# EasyEDA schematic bike_meter.json
TITLE: Sheet_1; REV: 1.0; Date: 2021-02-28; Sheet: 1/1; Company: Your Company
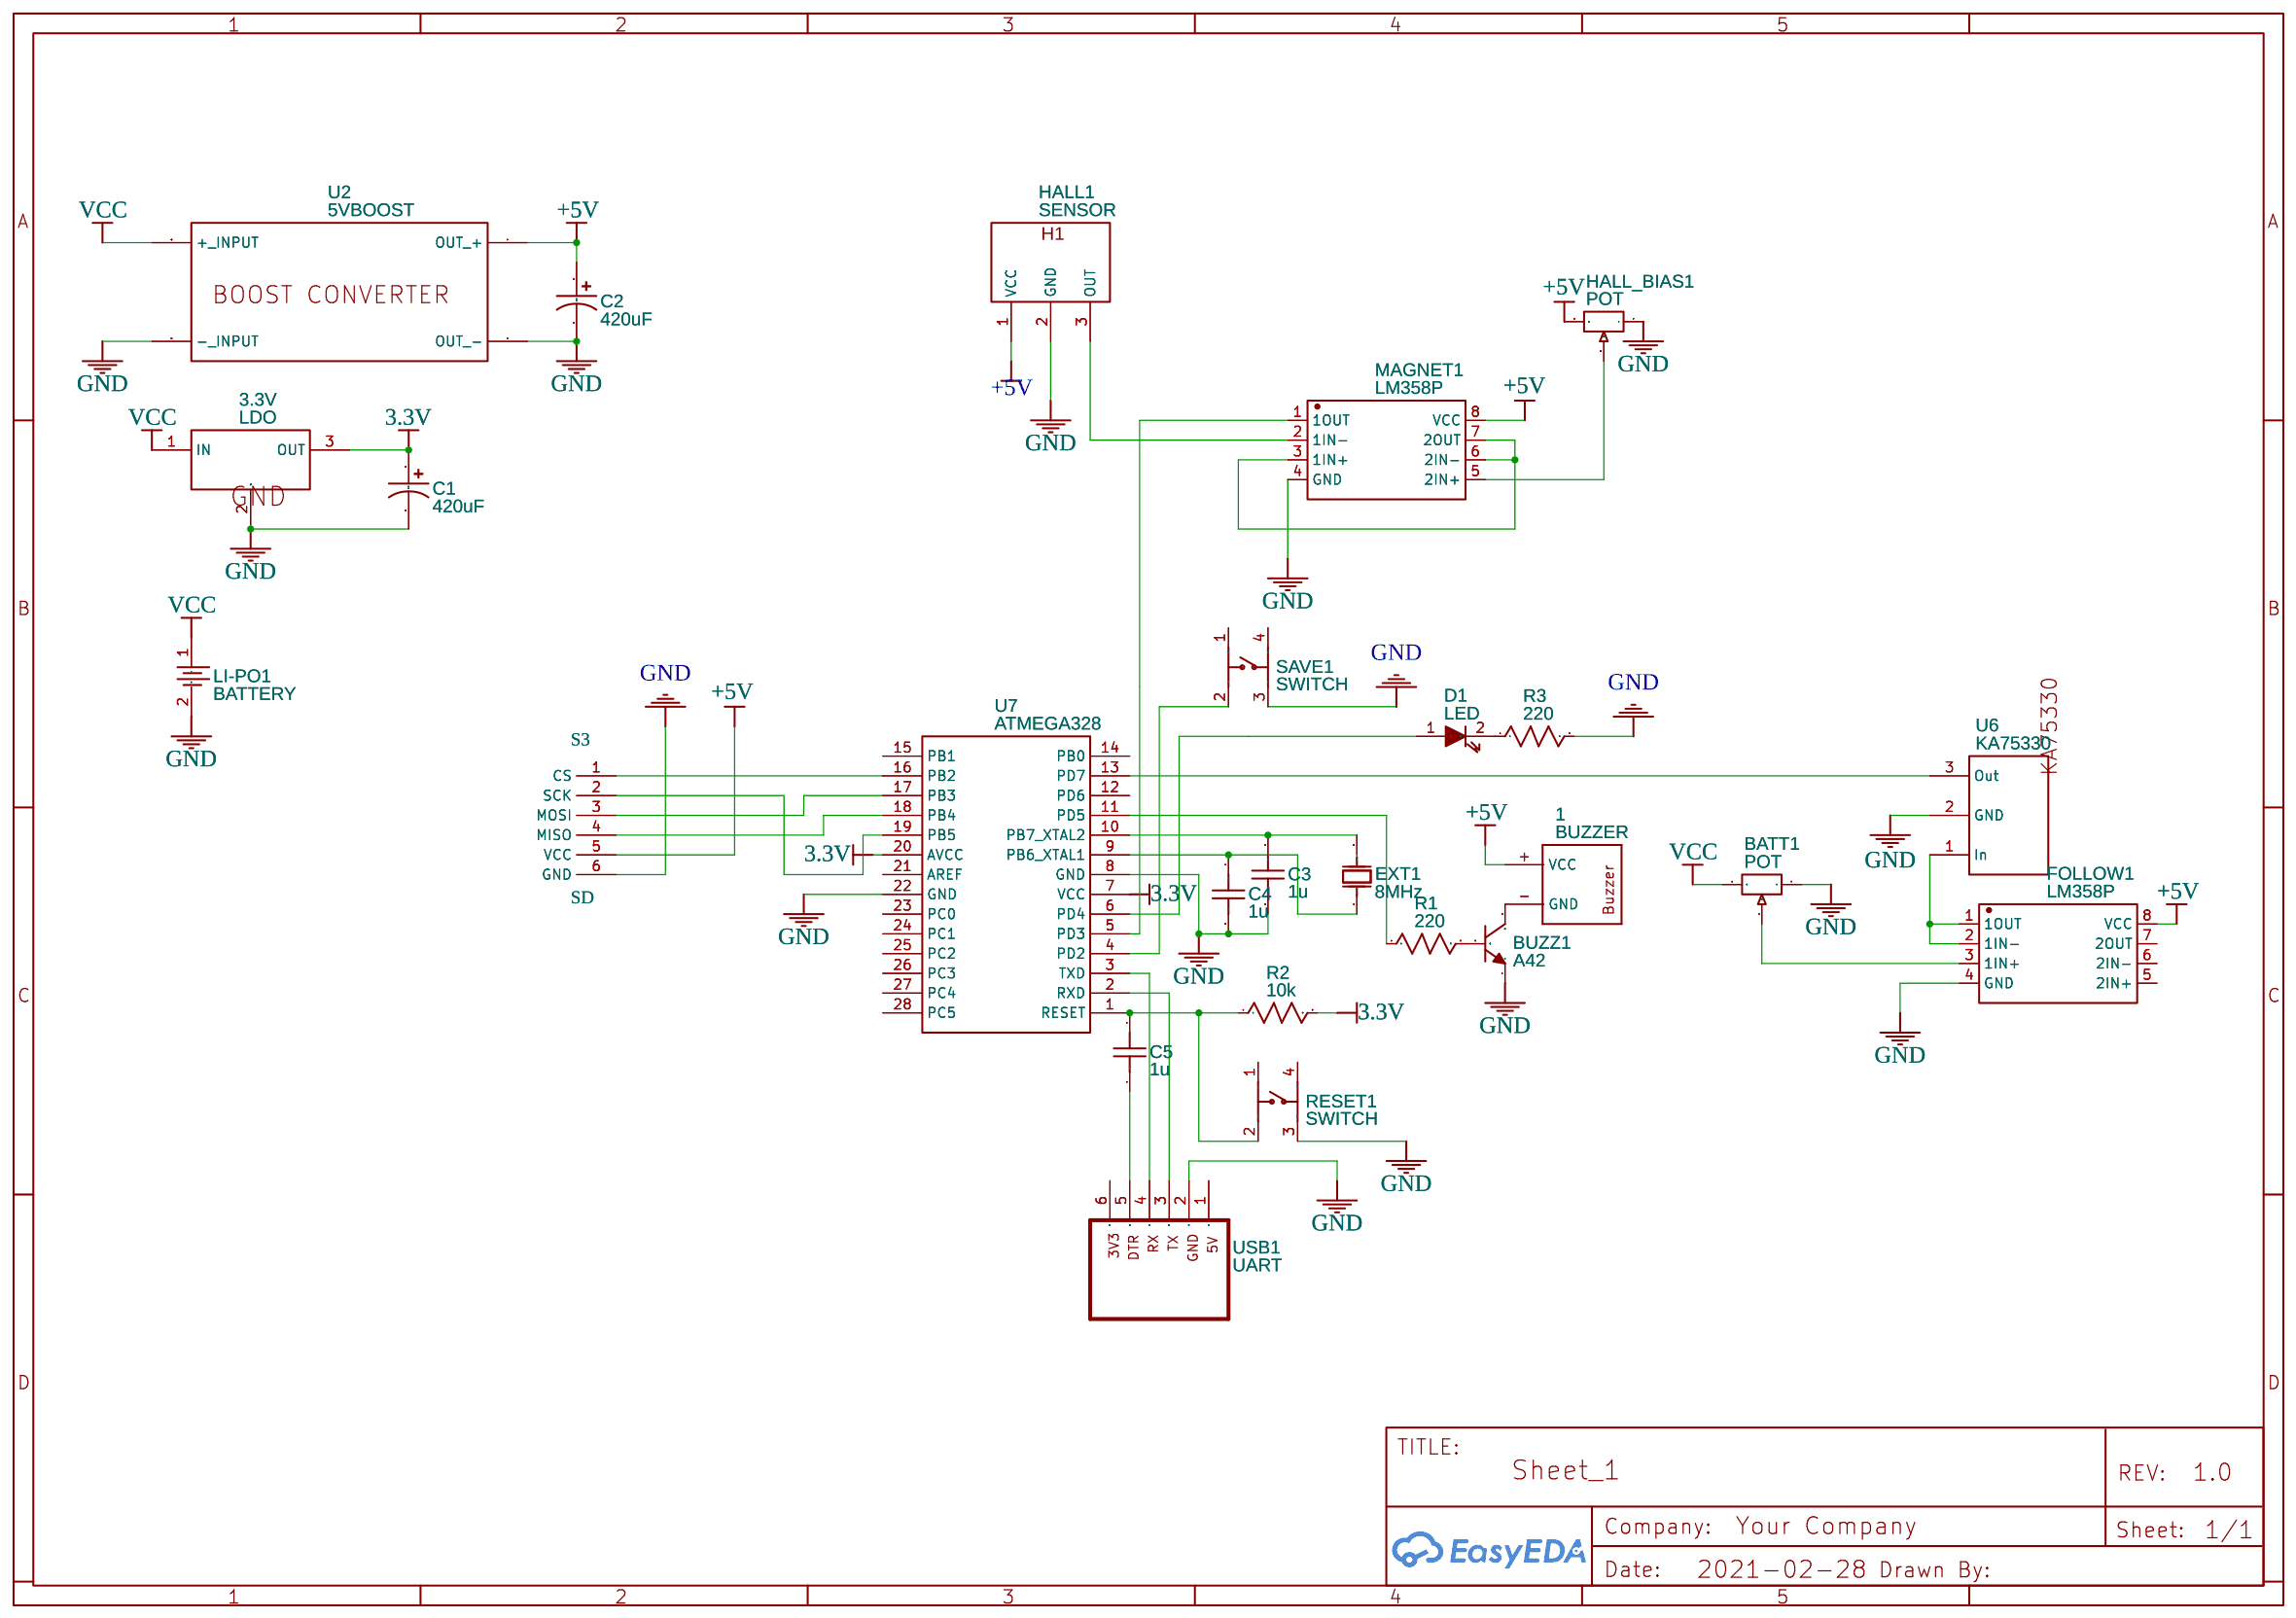
[diagram p0: schematic sheet]

## Parts
1  BUZZER  [BUZZER-12MM-NS-KIT]
3.3V  LDO  [3.3V LDO REGULATOR]
BATT1  POT  [POTENTIOMETER_TRIMMER_BOURNS_3296W]
BUZZ1  A42  [A42 2.54]
C1  420uF  [CAPACITOR]
C2  420uF  [CAPACITOR]
C3  1u  [2.5MM CERAMIC CAP]
C4  1u  [2.5MM CERAMIC CAP]
C5  1u  [2.5MM CERAMIC CAP]
D1  LED  [LED-TH_BD5.8-P2.54-L-RD]
EXT1  8MHz  [4 MHZ OSCILLATOR]
FOLLOW1  LM358P  [DIP-8_L9.4-W6.4-P2.54-LS9.1-BL]
HALL1  SENSOR  [3 PIN]
HALL_BIAS1  POT  [POTENTIOMETER_TRIMMER_BOURNS_3296W]
LI-PO1  BATTERY  [2PIN]
MAGNET1  LM358P  [DIP-8_L9.4-W6.4-P2.54-LS9.1-BL]
R1  220  [1/8W RESISTOR]
R2  10k  [1/8W RESISTOR]
R3  220  [1/8W RESISTOR]
RESET1  SWITCH  [KEY-TH_4P-L6.0-W6.0-P4.50-LS7.5]
S3  SD  [6PIN]
SAVE1  SWITCH  [KEY-TH_4P-L6.0-W6.0-P4.50-LS7.5]
U2  5VBOOST  [BOOST5V]
U6  KA75330  [TO-92(TO-92-3)]
U7  ATMEGA328  [DIP-28_300MIL]
USB1  UART  [USB_UART_CP2102]

## Library data of the parts
1 = BUZZER: Contributor: joergschuetz
3.3V = 7805(SOT-89): Supplier: LCSC; Manufacturer: CJ; Manufacturer Part: CJ78L05; image: //image.lceda.cn/szlcsc/C2079.jpg; Supplier Part: C2079; LCSC Assembly: Yes; SMT Type: Extend; Contributor: LCEDA_Lib
BATT1 HALL_BIAS1 = R_3386P_EU: Supplier: LCSC; Contributor: LCEDA_Lib; Value(Ω): 10K
BUZZ1 = 2N3904(SOT-23): Supplier: LCSC; Manufacturer: KEC; Manufacturer Part: 2n3904S-RTK/PS; Supplier Part: C18536; SMT Type: SOT-23; Contributor: LCEDA_Lib
C1 C2 = CE_TH_D10.0×F5.0_US: Contributor: LCEDA_Lib
C3-C5 = C_RAD-0.3_US: Contributor: LCEDA_Lib
D1 = LED: Contributor: Jacopo Franco
EXT1 = NX5032GA-8MHZ(STD-CSK-7): Supplier: Mouser; Supplier Part: 717-7A-8.000MAAE-T; Manufacturer: TXC Corporation; Manufacturer Part: 7A-8.000MAAE-T; Contributor: Roar Elias Georgsen; LCSC Assembly: Yes; SMT Type: Extend; Package Display: No
FOLLOW1 MAGNET1 = LM358P: Supplier: LCSC; Manufacturer: TI; image: //image.lceda.cn/szlcsc/C5213.jpg; Supplier Part: C5213
HALL1 = hall: Contributor: hicalsohan
LI-PO1 = CR1220-2: Supplier: LCSC; Manufacturer: Q&J; image: //image.lceda.cn/szlcsc/C70381.jpg; Supplier Part: C70381
R1-R3 = R_0603_US: Contributor: LCEDA_Lib
RESET1 SAVE1 = button6*6*8: Supplier Part: C59982; Supplier: LCSC; Manufacturer: ReliaPro; image: http://image.lceda.cn/szlcsc/C59982.jpg
U2 = boostyconverter: catid: 20; Contributor: shocc; Manufacturer Part: New SchematicLib
U6 = KA75330: link: http://pdf1.alldatasheet.com/datasheet-pdf/view/53255/FAIRCHILD/KA75330.html; Contributor: simonb
U7 = ATMEGA328: sourceId: Oic6oiASL; Supplier: LCSC; Manufacturer: MICROCHIP; Manufacturer Part: ATMEGA328P-PU; image: //image.lceda.cn/szlcsc/C33901.jpg; Contributor: LCSC; Supplier Part: C33901; Package Display: No
USB1 = UART: PatternAgents Peripheral Module UART (Type 4) Pattern; Contributor: PatternAgents

## Nets
3.3V: 3.3V.3(OUT) C1.1 R2.2 U7.7(VCC) U7.20(AVCC)
+5V: 1.+(VCC) C2.1 FOLLOW1.8(VCC) HALL1.1(VCC) HALL_BIAS1.3 MAGNET1.8(VCC) S3.5(VCC) U2.1(OUT +)
GND: 3.3V.2(GND) BATT1.1 BUZZ1.1(E) C1.2 C2.2 C3.2 C4.2 FOLLOW1.4(GND) HALL1.2(GND) HALL_BIAS1.1 LI-PO1.2 MAGNET1.4(GND) R3.2 RESET1.3 S3.6(GND) SAVE1.3 U2.4(OUT -) U2.6(- INPUT) U6.2(GND) U7.8(GND) U7.22(GND) USB1.2
VCC: 3.3V.1(IN) BATT1.3 LI-PO1.1 U2.5(+ INPUT)
Net-(1--): 1.-(GND) BUZZ1.3(C)
Net-(BATT1-2): BATT1.2 FOLLOW1.3(1IN+)
Net-(BUZZ1-2): BUZZ1.2(B) R1.2
Net-(C3-1): C3.1 EXT1.2(OSC2) U7.10(PB7 XTAL2)
Net-(C4-1): C4.1 EXT1.1(OSC1) U7.9(PB6 XTAL1)
Net-(C5-1): C5.1 R2.1 RESET1.2 U7.1(RESET)
Net-(C5-2): C5.2 USB1.5
Net-(D1-1): D1.1(A) U7.6(PD4)
Net-(D1-2): D1.2(K) R3.1
Net-(FOLLOW1-1): FOLLOW1.1(1OUT) FOLLOW1.2(1IN-) U6.1(In)
Net-(HALL1-3): HALL1.3(OUT) MAGNET1.2(1IN-)
Net-(HALL_BIAS1-2): HALL_BIAS1.2 MAGNET1.5(2IN+)
Net-(MAGNET1-1): MAGNET1.1(1OUT) U7.5(PD3)
Net-(MAGNET1-3): MAGNET1.3(1IN+) MAGNET1.6(2IN-) MAGNET1.7(2OUT)
Net-(R1-1): R1.1 U7.11(PD5)
Net-(S3-1): S3.1(CS) U7.16(PB2)
Net-(S3-2): S3.2(SCK) U7.19(PB5)
Net-(S3-3): S3.3(MOSI) U7.17(PB3)
Net-(S3-4): S3.4(MISO) U7.18(PB4)
Net-(SAVE1-2): SAVE1.2 U7.4(PD2)
Net-(U6-3): U6.3(Out) U7.13(PD7)
Net-(U7-2): U7.2(RXD) USB1.3
Net-(U7-3): U7.3(TXD) USB1.4

Not connected (* = marked no-connect by the designer): FOLLOW1 5(2IN+) 6(2IN-) 7(2OUT); RESET1 1 4; SAVE1 1 4; U7 12(PD6) 14(PB0) 15(PB1) 21(AREF) 23(PC0) 24(PC1) 25(PC2) 26(PC3) 27(PC4) 28(PC5); USB1 1 6
